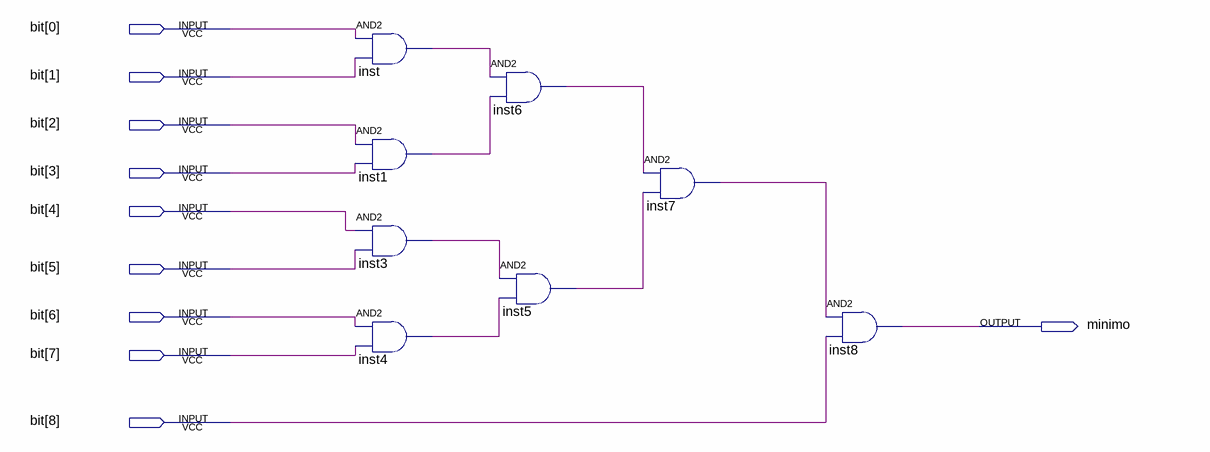
[diagram p0: schematic sheet]
// Quartus schematic minimo.bdf as structural Verilog: 8 symbols, 10 pins
module minimo (
  input  [8:0] \bit ,
  output minimo
);

  wire inst1_out, inst3_out, inst4_out, inst5_out, inst6_out, inst7_out, inst_out;

  and inst (inst_out, \bit [0], \bit [1]);
  and inst1 (inst1_out, \bit [2], \bit [3]);
  and inst3 (inst3_out, \bit [4], \bit [5]);
  and inst4 (inst4_out, \bit [6], \bit [7]);
  and inst6 (inst6_out, inst_out, inst1_out);
  and inst5 (inst5_out, inst3_out, inst4_out);
  and inst7 (inst7_out, inst6_out, inst5_out);
  and inst8 (minimo, inst7_out, \bit [8]);
endmodule
